# Altium schematic sheet Neopixel_LED.SchDoc: RGB Illumination LED
size A4; DrawnBy: Samyar Sadat Akhavi; Revision: 1.0; SheetNumber: 3; SheetTotal: 3
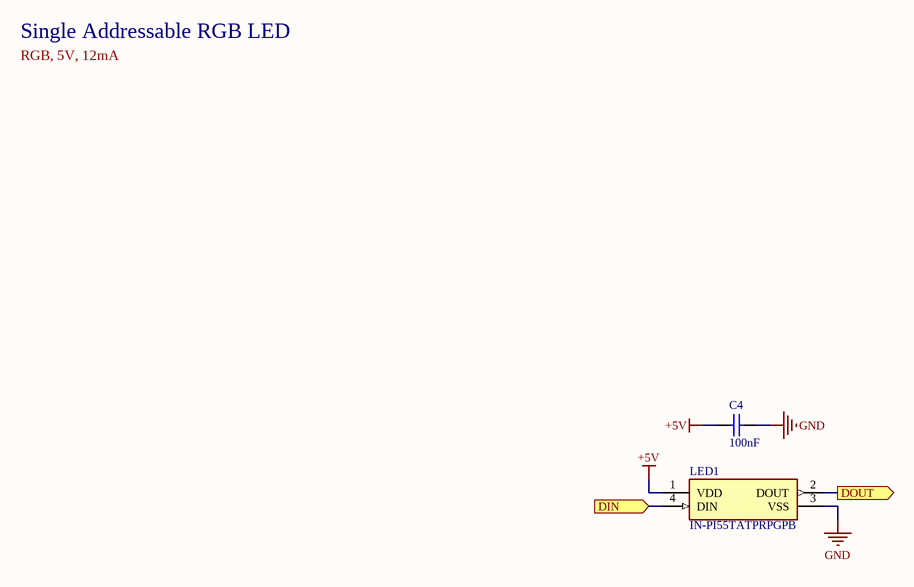
[diagram p0: Neopixel_LED.SchDoc]

## Parts
?  (no value)  (graphical)
C4  100nF  [CAP_SMD_603]
LED1  IN-PI55TATPRPGPB  [INPI55TATPRPGPB]

## Ports
DIN (in, see Camera_LED_Module[3B]), DOUT (out, see Camera_LED_Module[3B])

## Nets
+5V: C4.1 LED1.1(VDD)
GND: C4.2 LED1.3(VSS)
DIN: LED1.4(DIN) ; port DIN
DOUT: LED1.2(DOUT) ; port DOUT

## Notes on the sheet
- Single Addressable RGB LED
- RGB, 5V, 12mA
- Sub-Project:
- Size:
- Drawn By:
- Revision:
- Date:
- File:
- Sheet:
- of

## Library data of the parts
? = Standard Title Block
C4 = Non-polar Capacitor: Generic Ceramic Capacitor; Voltage: 16V; Value: 100nF
LED1 = IN-PI55TATPRPGPB: LED (Multiple); Manufacturer_Name: Inolux; Datasheet Link: https://www.futureelectronics.com/p/semiconductors--lighting-solutions--led-light-modules/in-pi55tatprpgpb-inolux-9107211; Height: 1.6mm; Manufacturer_Part_Number: IN-PI55TATPRPGPB; Mouser Part Number: 743-IN-PI55TATPRPGPB; Mouser Price/Stock: https://www.mouser.co.uk/ProductDetail/Inolux/IN-PI55TATPRPGPB?qs=mAH9sUMRCttUWI%2F2sR%2FcZg%3D%3D; Arrow Part Number: IN-PI55TATPRPGPB; Arrow Price/Stock: https://www.arrow.com/en/products/in-pi55tatprpgpb/inolux-corporation?region=nac